# EAGLE design UTAP2022_DAUGHTER_v1.0 (EAGLE 7.5.0)
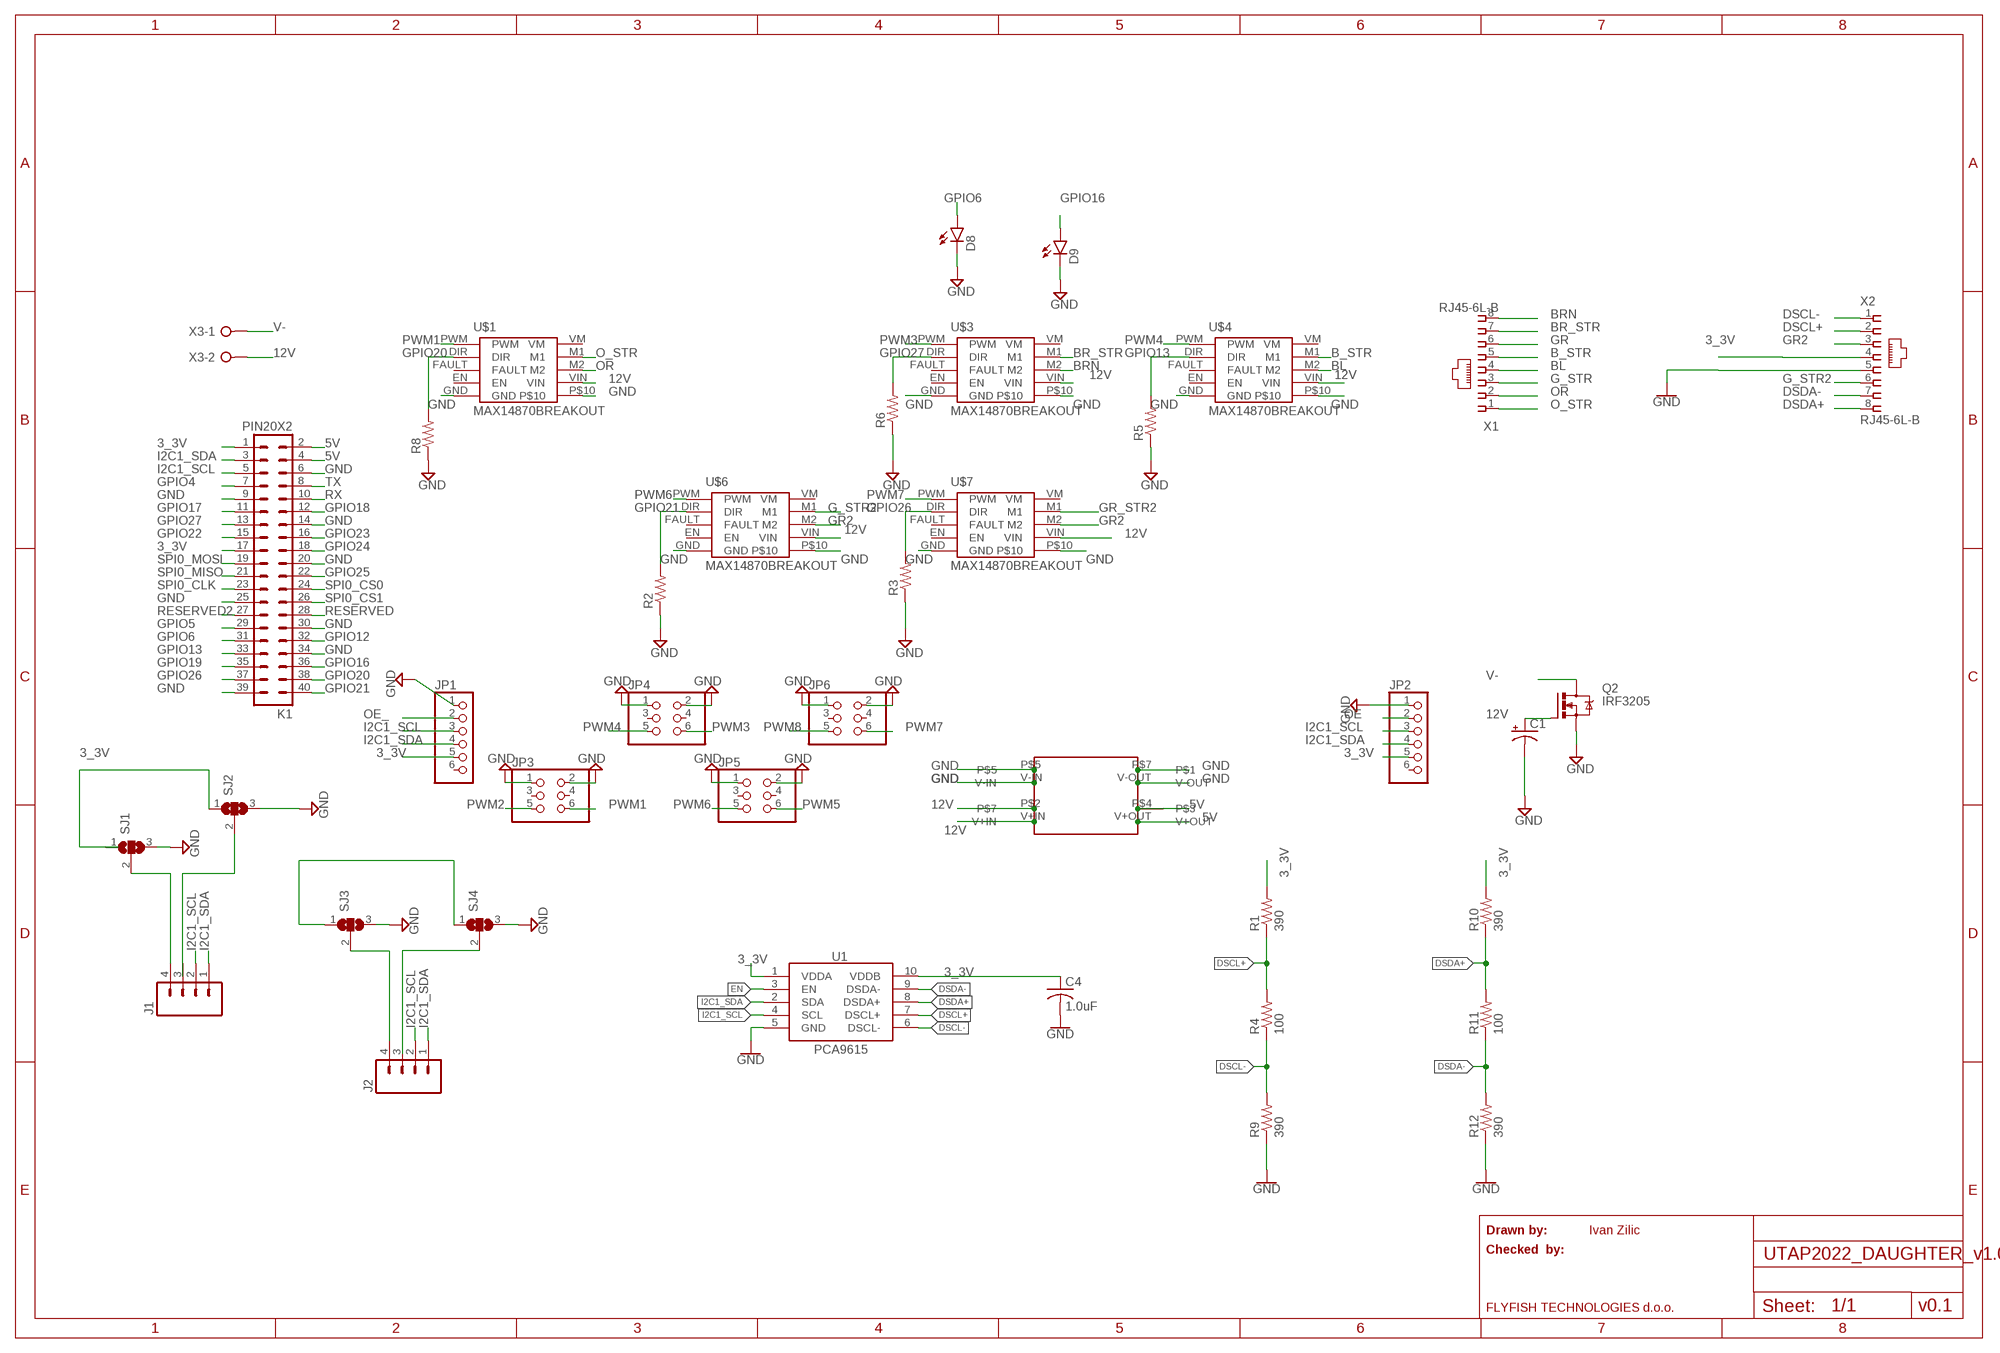
[diagram p0: schematic, sheet 1]

## Parts
C1  CAP_POLPTH1  [CPOL-RADIAL-100UF-25V]
C4  1.0uF  C-US050-024X044  [C050-024X044]
D8  LED5MM  [LED5MM]
D9  LED5MM  [LED5MM]
J1  M04PTH  [1X04]
J2  M04PTH  [1X04]
JP1  PINHD-1X6  [1X06]
JP2  PINHD-1X6  [1X06]
JP3  PINHD-2X3  [2X03]
JP4  PINHD-2X3  [2X03]
JP5  PINHD-2X3  [2X03]
JP6  PINHD-2X3  [2X03]
K1  PIN20X2  [PIN_20X2]
Q2  IRF3205  IRF540  [TO220BV]
R1  390  R-US_0204/7  [0204/7]
R2  R-US_0204/7  [0204/7]
R3  R-US_0204/7  [0204/7]
R4  100  R-US_0204/7  [0204/7]
R5  R-US_0204/7  [0204/7]
R6  R-US_0204/7  [0204/7]
R8  R-US_0204/7  [0204/7]
R9  390  R-US_0204/7  [0204/7]
R10  390  R-US_0204/7  [0204/7]
R11  100  R-US_0204/7  [0204/7]
R12  390  R-US_0204/7  [0204/7]
SJ1  SJ2W  [SJ_2]
SJ2  SJ2W  [SJ_2]
SJ3  SJ2W  [SJ_2]
SJ4  SJ2W  [SJ_2]
U1  PCA9615  [TSSOP10]
U$1  MAX14870BREAKOUT  [MAX14870_BREAKOUT]
U$3  MAX14870BREAKOUT  [MAX14870_BREAKOUT]
U$4  MAX14870BREAKOUT  [MAX14870_BREAKOUT]
U$6  MAX14870BREAKOUT  [MAX14870_BREAKOUT]
U$7  MAX14870BREAKOUT  [MAX14870_BREAKOUT]
U$9  MP1584EN  [BUCK_CONV]
X1  RJ45-6L-B  [RJ45-NO-SHIELD]
X2  RJ45-6L-B  [RJ45-NO-SHIELD]
X3  W237-02P  [W237-132]

## Nets
3_3V: C4.1 JP1.5 JP2.5 K1.1 K1.17 R1.2 R10.2 SJ2.1 SJ3.1 SJ4.1 U1.1(VDDA) U1.10(VDDB) X2.4
5V [5V]: K1.2 K1.4 U$9.P$4 U$9.V+OUT
12V [POWER]: C1.1(+) Q2.G U$1.VIN U$3.VIN U$4.VIN U$6.VIN U$7.VIN U$9.P$2 U$9.V+IN X3.2
B_STR [MOTOR]: U$4.M1 X1.5
BL [MOTOR]: U$4.M2 X1.4
BR_STR [MOTOR]: U$3.M1 X1.7
BRN [MOTOR]: U$3.M2 X1.8
DSCL+: R1.1 R4.2 U1.7(DSCL+) X2.2
DSCL-: R4.1 R9.2 U1.6(DSCL-) X2.1
DSDA+: R10.1 R11.2 U1.8(DSDA+) X2.8
DSDA-: R11.1 R12.2 U1.9(DSDA-) X2.7
EN: U1.3(EN)
G_STR [MOTOR]: X1.3
G_STR2 [MOTOR]: U$6.M1 X2.6
GND [POWER]: C1.2(-) C4.2 D8.K(C) D9.K(C) JP1.1 JP2.1 JP3.1 JP3.2 JP4.1 JP4.2 JP5.1 JP5.2 JP6.1 JP6.2 K1.6 K1.9 K1.14 K1.20 K1.25 K1.30 K1.34 K1.39 Q2.S R2.1 R3.1 R5.1 R6.1 R8.1 R9.1 R12.1 SJ1.3 SJ2.3 SJ3.3 SJ4.3 U1.5(GND) U$1.GND U$1.P$10 U$3.GND U$3.P$10 U$4.GND U$4.P$10 U$6.GND U$6.P$10 U$7.GND U$7.P$10 U$9.P$5 U$9.P$7 U$9.V-IN U$9.V-OUT X2.5
GPIO4: K1.7
GPIO5: K1.29
GPIO6: D8.A K1.31
GPIO12: K1.32
GPIO13: K1.33 R5.2 U$4.DIR
GPIO16: D9.A K1.36
GPIO17: K1.11
GPIO18: K1.12
GPIO19: K1.35
GPIO20: K1.38 R8.2 U$1.DIR
GPIO21: K1.40 R2.2 U$6.DIR
GPIO22: K1.15
GPIO23: K1.16
GPIO24: K1.18
GPIO25: K1.22
GPIO26: K1.37 R3.2 U$7.DIR
GPIO27: K1.13 R6.2 U$3.DIR
GR [MOTOR]: X1.6
GR2 [MOTOR]: U$6.M2 U$7.M2 X2.3
GR_STR2 [MOTOR]: U$7.M1
I2C1_SCL: J1.2 J2.2 JP1.3 JP2.3 K1.5 U1.4(SCL)
I2C1_SDA: J1.1 J2.1 JP1.4 JP2.4 K1.3 U1.2(SDA)
N$3: J1.4 SJ1.2
N$4: SJ2.2
N$5: J2.4 SJ3.2
N$6: SJ4.2
O_STR [MOTOR]: U$1.M1 X1.1
OE: JP2.2
OE_: JP1.2
OR [MOTOR]: U$1.M2 X1.2
PWM1: JP3.6 U$1.PWM
PWM2: JP3.5
PWM3: JP4.6 U$3.PWM
PWM4: JP4.5 U$4.PWM
PWM5: JP5.6
PWM6: JP5.5 U$6.PWM
PWM7: JP6.6 U$7.PWM
PWM8: JP6.5
RESERVED: K1.28
RESERVED2: K1.27
RX: K1.10
SPI0_CLK: K1.23
SPI0_CS0: K1.24
SPI0_CS1: K1.26
SPI0_MISO: K1.21
SPI0_MOSI: K1.19
TX: K1.8
V- [POWER]: Q2.D X3.1
Unconnected: J1.3 J2.3 JP1.6 JP2.6 JP3.3 JP3.4 JP4.3 JP4.4 JP5.3 JP5.4 JP6.3 JP6.4 SJ1.1 U$1.EN U$1.FAULT U$1.VM U$3.EN U$3.FAULT U$3.VM U$4.EN U$4.FAULT U$4.VM U$6.EN U$6.FAULT U$6.VM U$7.EN U$7.FAULT U$7.VM

## Notes on the sheet
- Drawn by: | Ivan Zilic
- Checked  by:
- FLYFISH TECHNOLOGIES d.o.o. | v0.1

## Library data of the parts
C1 = SparkFun-Passives:CAP_POL: Capacitor Polarized These are standard SMD and PTH capacitors. Normally 10uF, 47uF, and 100uF in electrolytic and tantalum varieties. Always verify the external diameter of the through hole cap, it varies with capacity, voltage, and manufacturer. The EIA devices should be standard.
C4 = rcl:C-US: CAPACITOR, American symbol
D8 D9 = SparkFun-LED:LED: LEDs Standard schematic elements and footprints for 5mm, 3mm, 1206, and 0603 sized LEDs. 5mm - Spark Fun Electronics SKU : COM-00529 (and others)
J1 J2 = SparkFun-Connectors:M04: Header 4 Standard 4-pin 0.1" header. Use with straight break away headers (SKU : PRT-00116), right angle break away headers (PRT-00553), swiss pins (PRT-00743), machine pins (PRT-00117), and female headers (PRT-00115). Molex polarized connector foot print use with SKU : PRT-08231 with associated crimp pins and housings. 1MM SMD Version SKU: PRT-10208; PROD_ID: CONN-09696
JP1 JP2 = pinhead:PINHD-1X6: PIN HEADER
JP3-JP6 = pinhead:PINHD-2X3: PIN HEADER
K1 = FLYFISH:PIN20X2
Q2 = transistor-power:IRF540: HEXFET Power MOSFET
R1-R6 R8-R12 = resistor:R-US_: RESISTOR, American symbol
SJ1-SJ4 = jumper:SJ2W: SMD solder JUMPER
U1 = SparkFun-IC-Comms:PCA9615: Differential I2C Bus Buffer Datasheet <https://www.nxp.com/docs/en/data-sheet/PCA9615.pdf>; PROD_ID: IC-13899
U$1 U$3 U$4 U$6 U$7 = MAX14870_BREAKOUT:MAX14870BREAKOUT
U$9 = MP1584EN:MP1584EN
X1 X2 = con-tycoelectronics:RJ45: CORCOM Modular RJ Jacks No Shield Source: www.tycoelectronics.com .. ENG_DS_1654001_1099_RJ_L_0507.pdf; MPN: RJ45-6L-B; OC_FARNELL: unknown; OC_NEWARK: 16R6090
X3 = con-wago-508:W237-02P: WAGO SREW CLAMP; OC_FARNELL: unknown; OC_NEWARK: unknown

## Net classes
0 default: width 0.254 mm, clearance 0.254 mm
1 POWER: width 2.032 mm, clearance 0.254 mm
2 MOTOR: width 1.016 mm, clearance 0.254 mm
3 5V: width 0.508 mm, clearance 0.254 mm

## Board
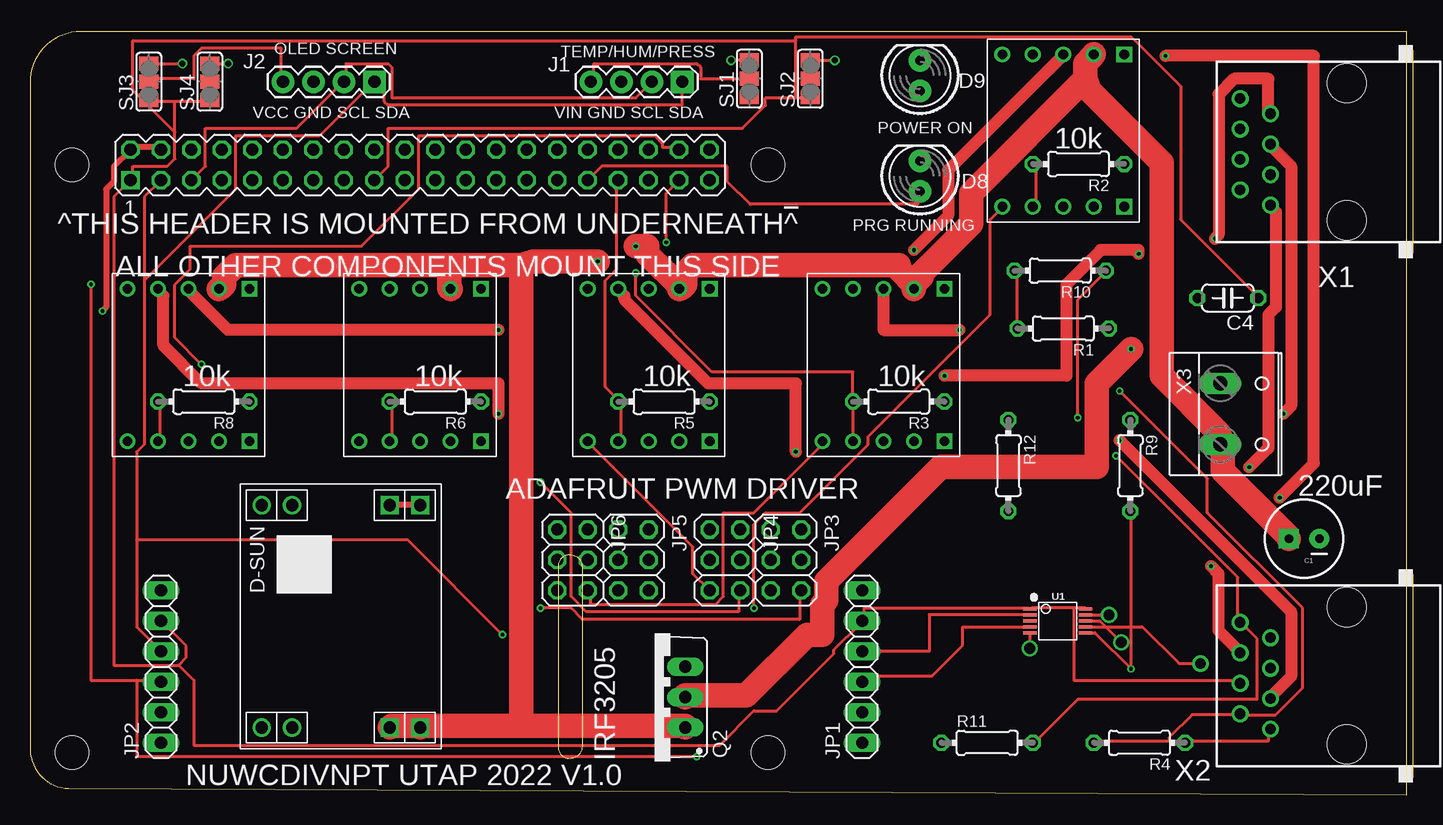
[diagram p1: board, top side]
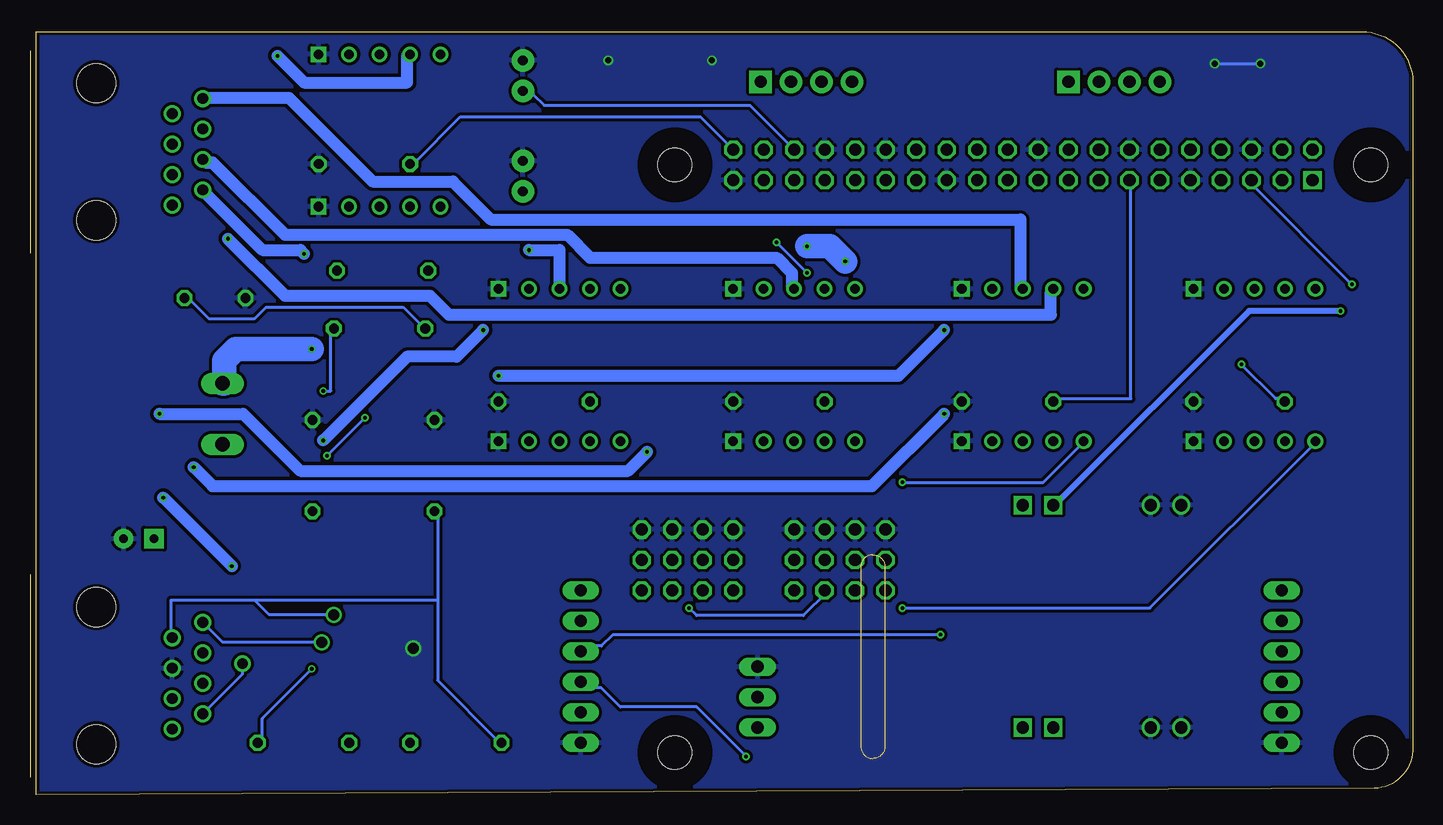
[diagram p2: board, bottom side, seen from below]

Size 114.72 x 63.62 mm. Coordinates in mm from the lower left corner, seen from the top.
Outline: 114.72,0 114.72,63.62 4.24,63.62 arc90 0,59.38 0,3.98 arc90 3.21,0.51 114.72,0
Copper layers (1*16): Top 0.035mm / dielectric 1.5mm / Bottom 0.035mm
Design rules "ITEADstudio_DRC *": minimum track width 6mil, minimum drill 12mil, track to track 6mil, track to pad 6mil, pad to pad 6mil, via to via 6mil, smd to smd 0mil, copper to edge 11mil, drill to drill 11mil, minimum pad ring 10mil, minimum via ring 6mil, stop-mask expansion 2mil, vias tented up to drill 100mil, thermal gap 10mil
Holes 2.8 mm at 3.5,3.5 3.5,52.5 61.5,52.5 61.5,3.5
tRestrict: area 1.9,51 to 5,54; area 60,51 to 63,54; area 60,1.9 to 63,5; area 1.9,1.9 to 5,5
bRestrict: area 1.9,1.9 to 5,5; area 1.9,51 to 5,54; area 60,1.9 to 63,5; area 60,51 to 63,54
Milling: 6 lines

### Footprints (pad centres in the part's own frame; a part is rotated, then mirrored left to right if it is on the bottom)
CPOL-RADIAL-100UF-25V = drill 0.7 pad 1.651 square: 1 1.27,0 | drill 0.7 pad 1.651: 2 -1.27,0
C050-024X044 = drill 0.813 octagon: 1 -2.54,0; 2 2.54,0
LED5MM = drill 0.813 pad 1.88: A -1.27,0; K 1.27,0
1X04 = drill 1.016 pad 1.88 square: 1 0,0 | drill 1.016 pad 1.88: 2 2.54,0; 3 5.08,0; 4 7.62,0
1X06 = drill 1.016 long: 1 -6.35,0; 2 -3.81,0; 3 -1.27,0; 4 1.27,0; 5 3.81,0; 6 6.35,0
2X03 = drill 1.016 octagon: 1 -2.54,-1.27; 2 -2.54,1.27; 3 0,-1.27; 4 0,1.27; 5 2.54,-1.27; 6 2.54,1.27
PIN_20X2 = drill 1.016 square: 1 -24.13,-1.27 | drill 1.016 octagon: 2 -24.13,1.27; 3 -21.59,-1.27; 4 -21.59,1.27; 5 -19.05,-1.27; 6 -19.05,1.27; 7 -16.51,-1.27; 8 -16.51,1.27; 9 -13.97,-1.27; 10 -13.97,1.27; 11 -11.43,-1.27; 12 -11.43,1.27; 13 -8.89,-1.27; 14 -8.89,1.27; 15 -6.35,-1.27; 16 -6.35,1.27; 17 -3.81,-1.27; 18 -3.81,1.27; 19 -1.27,-1.27; 20 -1.27,1.27; 21 1.27,-1.27; 22 1.27,1.27; 23 3.81,-1.27; 24 3.81,1.27; 25 6.35,-1.27; 26 6.35,1.27; 27 8.89,-1.27; 28 8.89,1.27; 29 11.43,-1.27; 30 11.43,1.27; 31 13.97,-1.27; 32 13.97,1.27; 33 16.51,-1.27; 34 16.51,1.27; 35 19.05,-1.27; 36 19.05,1.27; 37 21.59,-1.27; 38 21.59,1.27; 39 24.13,-1.27; 40 24.13,1.27
TO220BV = drill 1.016 long: D 0,-2.54; G -2.54,-2.54; S 2.54,-2.54
0204/7 = drill 0.813 octagon: 1 -3.81,0; 2 3.81,0
SJ_2 = smd 1.168 x 1.6: 1 -1.524,0; 2 0,0; 3 1.524,0
TSSOP10 = smd 1.1 x 0.25: 1 -2.259,1.018; 2 -2.259,0.517; 3 -2.259,0.018; 4 -2.259,-0.482; 5 -2.259,-0.988; 6 2.366,-0.988; 7 2.366,-0.482; 8 2.366,0.018; 9 2.366,0.517; 10 2.366,1.018
MAX14870_BREAKOUT = drill 0.8: DIR -6.35,2.54; EN -6.35,-2.54; FAULT -6.35,0; M1 6.35,2.54; M2 6.35,0; PWM -6.35,5.08; VIN 6.35,-2.54; VM 6.35,5.08 | drill 0.8 square: GND -6.35,-5.08; P$10 6.35,-5.08
BUCK_CONV = drill 1.016 square: P$2 1.778,4.318; P$4 20.32,4.318; V+IN 1.778,1.778; V+OUT 20.32,1.778 | drill 1.016: P$5 1.778,14.986; P$7 20.32,14.986; V-IN 1.778,12.446; V-OUT 20.32,12.446
RJ45-NO-SHIELD = drill 0.9 pad 1.4: 1 -4.445,6.35; 2 -3.175,8.89; 3 -1.905,6.35; 4 -0.635,8.89; 5 0.635,6.35; 6 1.905,8.89; 7 3.175,6.35; 8 4.445,8.89 | hole 3.251: -5.715,0; 5.715,0
W237-132 = drill 1.194 long: 1 -2.54,-0.635; 2 2.54,-0.635

### Placement (x,y rotation side)
C1  106.17,21.34 180 top
C4  99.82,41.4 180 top
D8  74.17,51.56 90 top
D9  74.17,59.94 90 top
J1  54.36,59.44 180 top
J2  28.7,59.44 180 top
JP1  69.34,10.67 90 top
JP2  10.92,10.67 90 top
JP3  62.99,19.56 270 top
JP4  57.91,19.56 270 top
JP5  50.29,19.56 270 top
JP6  45.21,19.56 270 top
K1  32.5,52.5 0 top
Q2  52.07,8.13 90 top
R1  86.11,38.86 180 top
R2  87.38,52.58 180 top
R3  72.39,32.77 180 top
R4  92.46,4.32 180 top
R5  52.83,32.77 180 top
R6  33.78,32.77 180 top
R8  14.48,32.77 180 top
R9  91.69,27.43 270 top
R10  85.85,43.69 180 top
R11  79.76,4.32 0 top
R12  81.53,27.43 270 top
SJ1  59.94,59.69 90 top
SJ2  65.02,59.69 90 top
SJ3  9.91,59.44 90 top
SJ4  14.99,59.44 90 top
U1  85.6,14.48 0 top
U$1  13.21,35.81 90 top
U$3  32.51,35.81 90 top
U$4  51.56,35.81 90 top
U$6  86.11,55.37 90 top
U$7  71.12,35.81 90 top
U$9  34.29,3.81 90 top
X1  109.73,53.59 90 top
X2  109.73,9.91 90 top
X3  99.82,31.75 270 top

### Tracks (layer width: path | path; a pad name or v marks a point on that pad's centre or on a via)
3_3V
  Top 0.254: R1.2 82.23,39.05 82.23,43.5 R10.2 | 63.82,58.1 61.28,58.1 61.28,57.47 59.37,55.56 29.84,55.56 29.84,52.39 28.89,51.44 K1.17 | 63.82,58.1 64.77,58.1 SJ2.1 | 63.82,58.1 63.82,62.87 | 63.82,62.87 63.82,63.18 91.76,63.18 95.89,59.05 95.89,47.94 102.23,41.59 C4.1 | 87,15.56 87.95,15.56 U1.10 | 87,15.56 83.5,15.56 U1.1 83.19,15.56 69.53,15.56 69.53,14.61 JP1.5 69.22,14.29 66.99,12.06 66.99,11.75 62.23,6.99 60.33,6.99 57.47,4.13 13.65,4.13 13.65,9.53 12.38,10.79 | 87,15.56 87,9.53 100.65,9.53 X2.4 | 12.06,57.78 14.92,57.78 SJ4.1 | 12.06,57.78 10.16,57.78 SJ3.1 | JP2.5 13.02,12.38 13.02,11.43 12.38,10.79 | 12.38,10.79 6.99,10.79 6.99,49.85 8.26,51.12 K1.1 8.57,51.44 8.57,52.39 11.43,52.39 12.06,53.02 12.06,55.24 | 12.06,55.24 12.06,57.78 | 63.82,62.87 8.57,62.87 8.57,58.74 12.06,55.24
  Bottom 0.254: R1.2 82.55,39.05 84.14,40.64 95.57,40.64 96.52,39.69 100.33,39.69 101.92,41.27 102.23,41.27 C4.1
5V  (via drill 0.3)
  Top 0.508: U$9.V+OUT U$9.P$4 | K1.4 10.79,53.98 8.57,53.98 K1.2 8.26,53.66 6.99,52.39 6.99,51.12 6.35,50.48 6.35,40.64 v6.03,40.32
  Bottom 0.508: v6.03,40.32 13.65,40.32 29.84,24.13 U$9.P$4
12V  (via drill 0.3)
  Top 2.032: 34.92,44.13 17.14,44.13 16.19,43.18 16.19,42.55 15.88,42.23 U$1.VIN | 34.92,44.13 34.92,42.23 U$3.VIN | 32.38,5.71 30.16,5.71 U$9.P$2 | 32.38,5.71 U$9.V+IN | 32.38,5.71 40.96,5.71 | 40.96,5.71 54.61,5.71 Q2.G | 40.96,44.13 34.92,44.13 | 40.96,5.71 40.96,44.13 | 99.38,29.21 99.38,26.99 104.78,21.59 C1.1 | 99.38,29.21 X3.2 | 54.29,42.23 54.61,42.55 54.61,43.5 55.24,44.13 72.39,44.13 72.39,43.81 73.66,42.55 | U$7.VIN 73.66,42.55 | 54.29,42.23 U$4.VIN | 87.95,59.69 87.95,60.96 88.58,61.59 U$6.VIN | 87.95,59.69 78.42,50.16 78.42,47.62 74.3,43.5 74.3,43.18 73.66,42.55 | 99.38,29.21 99.06,30.16 94.3,34.92 94.3,52.7 88.27,58.74 87.95,59.69 | v47.31,44.45 41.91,44.45 40.96,44.13 | v50.48,45.72 51.44,45.72 51.44,45.09 54.29,42.23
  Bottom 2.032: v47.31,44.45 48.58,45.72 v50.48,45.72
B_STR  (via drill 0.3)
  Top 1.016: v63.82,28.57 63.82,34.29 56.52,34.29 49.53,41.27 49.53,41.59 49.21,41.91 U$4.M1 | v104.46,31.75 105.09,32.38 105.09,52.39 103.5,53.98 X1.5
  Bottom 1.016: v63.82,28.57 65.41,26.99 92.71,26.99 97.47,31.75 v104.46,31.75
BL
  Bottom 1.016: U$4.M2 51.75,42.23 51.75,43.5 53.02,44.77 68.58,44.77 70.48,46.67 93.98,46.67 100.01,52.7 100.65,52.7 X1.4
BR_STR  (via drill 0.3)
  Top 1.016: v98.74,46.35 99.06,46.67 99.06,58.42 100.33,59.69 103.19,59.69 103.19,56.83 X1.7
  Bottom 1.016: v98.74,46.35 93.98,41.59 81.92,41.59 80.33,40.01 30.16,40.01 30.16,41.91 U$3.M1
BRN
  Bottom 1.016: U$3.M2 32.7,42.23 32.7,47.94 76.83,47.94 80.01,51.12 86.68,51.12 93.66,58.1 100.65,58.1 X1.8
DSCL+  (via drill 0.3, 0.9)
  Top 0.254: R4.2 88.9,4.45 94.93,4.45 94.93,4.76 96.84,6.67 100.65,6.67 X2.2 100.97,6.67 103.82,6.67 106.05,8.89 106.05,15.56 98.11,23.5 98.11,26.35 v90.81,33.66 | U1.7 92.68,13.99 95.76,10.92 v97.54,10.92
  Bottom 0.254: v90.81,33.66 90.17,33.66 90.17,38.73 R1.1 | v97.54,10.92 97.54,10.03 X2.2
DSCL-  (via drill 0.3)
  Top 0.254: R4.1 96.52,4.45 103.19,4.45 103.19,5.4 X2.1 | R9.2 91.76,23.5 v91.76,10.48 88.75,13.49 U1.6
  Bottom 0.254: v91.76,10.48 95.89,6.35 95.89,4.45 96.2,4.45 R4.1
DSDA+  (via drill 0.3, 0.9)
  Top 0.254: R11.2 83.82,4.45 87.31,7.94 102.23,7.94 102.23,13.02 100.97,14.29 X2.8 100.65,14.61 100.65,18.1 v90.49,28.26 | v87.31,31.43 87.31,41.27 89.53,43.5 R10.1 | U1.8 89.14,14.49 v90.93,12.7
  Bottom 0.254: v90.49,28.26 v87.31,31.43 | v90.93,12.7 99.19,12.7 X2.8
DSDA-  (via drill 0.9)
  Top 0.254: U1.9 89.91,14.99 v89.92,14.99
  Bottom 0.254: 81.28,16.19 81.28,23.5 R12.2 | 81.28,16.19 81.28,9.53 76.2,4.45 R11.1 | 81.28,16.19 96.52,16.19 | 96.52,16.19 103.5,16.19 103.5,13.34 X2.7 | v89.92,14.99 95.31,14.99 96.52,16.19
G_STR2  (via drill 0.3)
  Top 1.016: v94.61,61.59 107,61.59 107,27.62 v104.14,24.77 | v98.42,19.05 99.06,18.41 99.06,13.65 100.65,12.06 X2.6
  Bottom 1.016: v94.61,61.59 92.39,59.37 83.82,59.37 83.82,61.59 U$6.M1 | v98.42,19.05 v104.14,24.77
GND  (via drill 0.5, 0.9)
  Top 0.254: U1.5 83.31,13.46 v83.31,12.19 83.31,11.94 | SJ3.3 v12.7,60.96 | SJ4.3 v16.51,60.96 | SJ1.3 v58.42,61.21 | SJ2.3 v67.06,61.21 67.31,61.21
  Bottom 0.254: v16.51,60.96 v12.7,60.96
  pour Bottom: 0.51,3.1 0.51,60.55 arc-90 3.21,63.25 114.3,63.25 114.3,0 3.61,0 arc-90
GPIO6
  Top 0.254: K1.31 46.67,51.44 47.62,52.39 58.1,52.39 58.1,51.12 60.01,49.21 73.98,49.21 73.98,50.16 D8.A
GPIO13
  Top 0.254: U$4.DIR 49.21,29.53 49.21,32.7 R5.2 48.9,33.02 47.94,33.97 47.94,42.86 48.9,43.81 48.9,51.12 K1.33
GPIO16
  Bottom 0.254: K1.36 51.75,53.98 55.24,57.47 72.39,57.47 73.34,58.42 73.98,58.42 D9.A
GPIO20  (via drill 0.3)
  Top 0.254: U$1.DIR 10.79,29.53 10.79,32.7 R8.2 | v14.29,35.88 12.06,38.1 12.06,42.55 13.34,43.81 13.34,45.72 27.62,45.72 32.38,50.48 32.38,54.93 52.07,54.93 52.7,54.29 52.7,53.98 53.98,53.98 K1.38
  Bottom 0.254: v14.29,35.88 11.43,33.02 10.79,33.02 R8.2
GPIO21
  Top 0.254: U$6.DIR 83.82,49.21 83.82,52.39 R2.2
  Bottom 0.254: K1.40 56.83,53.98 59.37,56.52 79.38,56.52 83.19,52.7 83.5,52.7 R2.2
GPIO26  (via drill 0.3)
  Top 0.254: U$7.DIR R3.2 68.58,35.24 56.83,35.24 50.48,41.59 v50.48,43.5 | v53.02,46.04 53.02,50.16 53.98,51.12 K1.37
  Bottom 0.254: v50.48,43.5 v53.02,46.04
GPIO27
  Top 0.254: U$3.DIR 30.16,29.53 30.16,32.7 R6.2
  Bottom 0.254: K1.13 23.5,51.12 23.5,33.02 29.84,33.02 R6.2
GR2  (via drill 0.3)
  Top 1.016: v73.66,45.4 76.52,48.26 76.52,52.07 86.04,61.59 U$6.M2 | v90.81,29.53 105.09,15.24 105.09,9.84 103.5,8.26 X2.3 | v77.47,38.73 71.12,38.73 U$7.M2
  Bottom 1.016: U$7.M2 71.12,45.4 v73.66,45.4 | v90.81,29.53 83.82,36.51 79.69,36.51 v77.47,38.73
I2C1_SCL  (via drill 0.3)
  Top 0.254: 8.89,9.53 5.08,9.53 v5.08,42.55 | 8.89,9.53 10.79,9.53 JP2.3 | v55.56,3.17 8.89,3.17 8.89,9.53 | K1.5 13.65,51.44 14.61,52.39 14.61,55.56 22.23,55.56 26.04,59.37 J2.2 26.35,59.69 26.35,60.96 29.84,60.96 30.16,60.64 30.16,58.1 50.48,58.1 J1.2 | JP1.3 69.34,9.91 75.18,9.91 77.72,12.45 77.72,13.97 83.06,13.97 | 83.06,13.97 83.82,13.97 | U1.4 83.06,13.99 83.06,13.97
  Bottom 0.254: v5.08,42.55 13.65,51.12 K1.5 | v55.56,3.17 59.69,7.3 66.04,7.3 67.63,8.89 68.9,8.89 69.22,9.21 JP1.3
I2C1_SDA  (via drill 0.3)
  Top 0.254: J1.1 54.29,59.37 54.29,57.47 29.84,57.47 29.53,57.78 29.53,58.74 28.89,59.37 J2.1 28.57,59.37 24.13,54.93 17.14,54.93 17.14,50.48 9.53,42.86 | JP2.4 8.89,13.97 8.89,21.27 | 8.89,21.27 8.89,28.57 9.53,29.21 9.53,42.86 | 9.53,42.86 9.53,49.85 10.79,51.12 K1.3 | v39.37,13.34 31.43,21.27 8.89,21.27 | U1.2 74.93,14.99 74.93,11.94 JP1.4
  Bottom 0.254: JP1.4 68.9,12.38 67.63,12.38 66.67,13.34 v39.37,13.34
N$3
  Top 0.254: SJ1.2 55.88,59.69 55.88,60.64 55.56,60.96 46.99,60.96 46.99,59.69 J1.4
N$5
  Top 0.254: SJ3.2 10.16,59.69 13.65,59.69 13.65,61.59 14.29,62.23 20.95,62.23 20.95,59.69 J2.4
O_STR  (via drill 0.3)
  Top 1.016: v39.05,31.75 39.05,34.29 14.29,34.29 11.11,37.47 11.11,41.59 10.79,41.91 U$1.M1 | v101.6,27.3 103.19,28.89 103.19,40.01 103.82,40.64 103.82,48.58 103.5,48.9 X1.1
  Bottom 1.016: v39.05,31.75 45.09,25.72 100.01,25.72 v101.6,27.3
OR  (via drill 0.3)
  Top 1.016: v39.05,38.73 16.51,38.73 13.34,41.91 U$1.M2 | v76.2,34.92 86.36,34.92 86.36,42.55 89.22,45.4 92.39,45.4 v92.39,45.09
  Bottom 1.016: v39.05,38.73 42.86,34.92 v76.2,34.92 | v92.39,45.09 92.71,45.4 95.89,45.4 100.65,50.16 X1.2
PWM1  (via drill 0.3)
  Top 0.254: v42.55,15.56 45.09,15.56 46.04,14.61 64.14,14.61 64.14,16.83 JP3.6
  Bottom 0.254: v42.55,15.56 21.91,15.56 8.26,29.21 U$1.PWM
PWM3  (via drill 0.3)
  Top 0.254: v42.55,26.04 45.09,23.5 45.09,16.51 46.35,15.24 59.05,15.24 59.05,16.83 JP4.6
  Bottom 0.254: v42.55,26.04 30.8,26.04 27.62,29.21 U$3.PWM
PWM4
  Top 0.254: JP4.5 55.24,18.41 55.24,20.64 46.67,29.21 U$4.PWM
PWM6  (via drill 0.3)
  Top 0.254: v60.33,15.56 60.33,22.54 61.28,23.5 64.14,23.5 69.85,29.21 69.85,29.84 80.01,40.01 80.01,47.94 80.96,48.9 U$6.PWM
  Bottom 0.254: v60.33,15.56 59.69,14.92 50.8,14.92 48.9,16.83 JP5.5
PWM7
  Top 0.254: U$7.PWM 66.04,29.21 60.33,23.5 57.78,23.5 57.78,16.51 57.15,15.88 46.67,15.88 46.67,16.83 JP6.6
V-  (via drill 0.3)
  Top 2.032: v91.76,37.15 88.9,34.29 88.9,27.3 75.88,27.3 66.36,17.78 66.36,16.19 66.04,15.88 66.04,13.34 64.77,13.34 59.69,8.26 54.61,8.26 Q2.D
  Bottom 2.032: v91.76,37.15 98.11,37.15 99.06,36.2 99.06,34.29 X3.1

### Text on the board
tNames: OLED SCREEN | TEMP/HUM/PRESS | VIN GND SCL SDA | VCC GND SCL SDA | POWER ON | 10k | PRG RUNNING | ^THIS HEADER IS MOUNTED FROM UNDERNEATH!^ | ALL OTHER COMPONENTS MOUNT THIS SIDE | 10k | 10k | 10k | 10k | ADAFRUIT PWM DRIVER | 220uF | IRF3205 | NUWCDIVNPT UTAP 2022 V1.0
bValues: ONLY THE 40 PIN HEADER IS CONNECTED TO THIS SIDE!!!